# EAGLE design untitled (EAGLE 6.1)
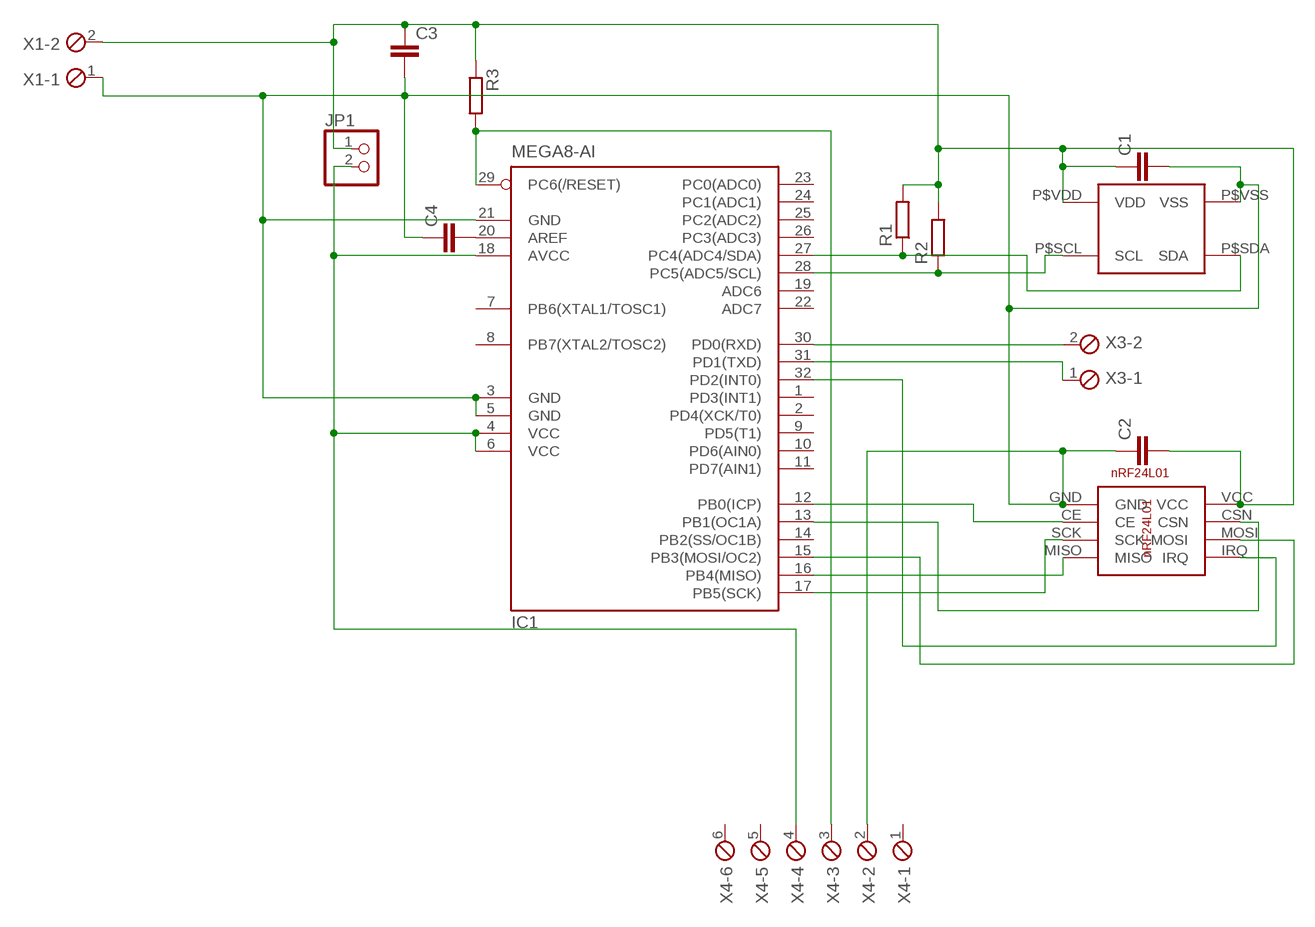
[diagram p0: schematic, sheet 1]

## Parts
C1  C-EUC1206  [C1206]
C2  C-EUC0805  [C0805]
C3  C-EU025-060X050  [C025-060X050]
C4  C-EUC0805K  [C0805K]
IC1  MEGA8-AI  [TQFP32-08]
JP1  PINHD-1X2  [1X02]
R1  R-EU_R0805  [R0805]
R2  R-EU_R0805  [R0805]
R3  R-EU_R0805  [R0805]
U$1  SHT21  [DFN6]
U$2  NRF24L01B  [B1]
X1  MPT2  [2POL254]
X3  MPT2  [2POL254]
X4  MPT6  [6POL254]

## Nets
N$1: IC1.32(PD2(INT0)) U$2.IRQ
N$2: IC1.15(PB3(MOSI/OC2)) U$2.MOSI
N$3: IC1.17(PB5(SCK)) U$2.SCK
N$4: IC1.16(PB4(MISO)) U$2.MISO
N$5: IC1.12(PB0(ICP)) U$2.CE
N$6: IC1.13(PB1(OC1A)) U$2.CSN
N$7: IC1.28(PC5(ADC5/SCL)) R2.1 U$1.P$SCL(SCL)
N$8: IC1.27(PC4(ADC4/SDA)) R1.1 U$1.P$SDA(SDA)
N$9: IC1.4(VCC) IC1.6(VCC) IC1.18(AVCC) JP1.2 X4.4
N$11: C4.2 IC1.20(AREF)
N$13: C1.2 C2.1 C3.2 C4.1 IC1.3(GND) IC1.5(GND) IC1.21(GND) U$1.P$VSS(VSS) U$2.GND X1.1 X4.2
N$14: C1.1 C2.2 C3.1 JP1.1 R1.2 R2.2 R3.1 U$1.P$VDD(VDD) U$2.VCC X1.2
N$17: IC1.29(PC6(/RESET)) R3.2 X4.3
N$21: IC1.30(PD0(RXD)) X3.2
N$22: IC1.31(PD1(TXD)) X3.1
Unconnected: IC1.1(PD3(INT1)) IC1.2(PD4(XCK/T0)) IC1.7(PB6(XTAL1/TOSC1)) IC1.8(PB7(XTAL2/TOSC2)) IC1.9(PD5(T1)) IC1.10(PD6(AIN0)) IC1.11(PD7(AIN1)) IC1.14(PB2(SS/OC1B)) IC1.19(ADC6) IC1.22(ADC7) IC1.23(PC0(ADC0)) IC1.24(PC1(ADC1)) IC1.25(PC2(ADC2)) IC1.26(PC3(ADC3)) X4.1 X4.5 X4.6

## Library data of the parts
C1 C2 C4 = resistor:C-EU: CAPACITOR, European symbol
C3 = rcl:C-EU: CAPACITOR, European symbol
IC1 = atmel:MEGA8: MICROCONTROLLER 8 Kbytes FLASH, 1 kbytes SRAM, 512 bytes EEPROM, USART, 6-channel 10 bit ADC, 2-channel 8 bit ADC Pin compatible with Atmega48, ATMega88, ATMega168 Source: avr.lbr; MPN: ATMEGA8-16AU; OC_FARNELL: 9171371; OC_NEWARK: 73M8863
JP1 = pinhead:PINHD-1X2: PIN HEADER
R1-R3 = resistor:R-EU_: RESISTOR, European symbol
U$1 = SHT21:SHT21
U$2 = nRF24L01:NRF24L01B
X1 X3 = con-phoenix-254:MPT2: PHOENIX CONNECTOR; OC_FARNELL: unknown; OC_NEWARK: unknown
X4 = con-phoenix-254:MPT6: PHOENIX CONNECTOR; OC_FARNELL: unknown; OC_NEWARK: unknown

## Board
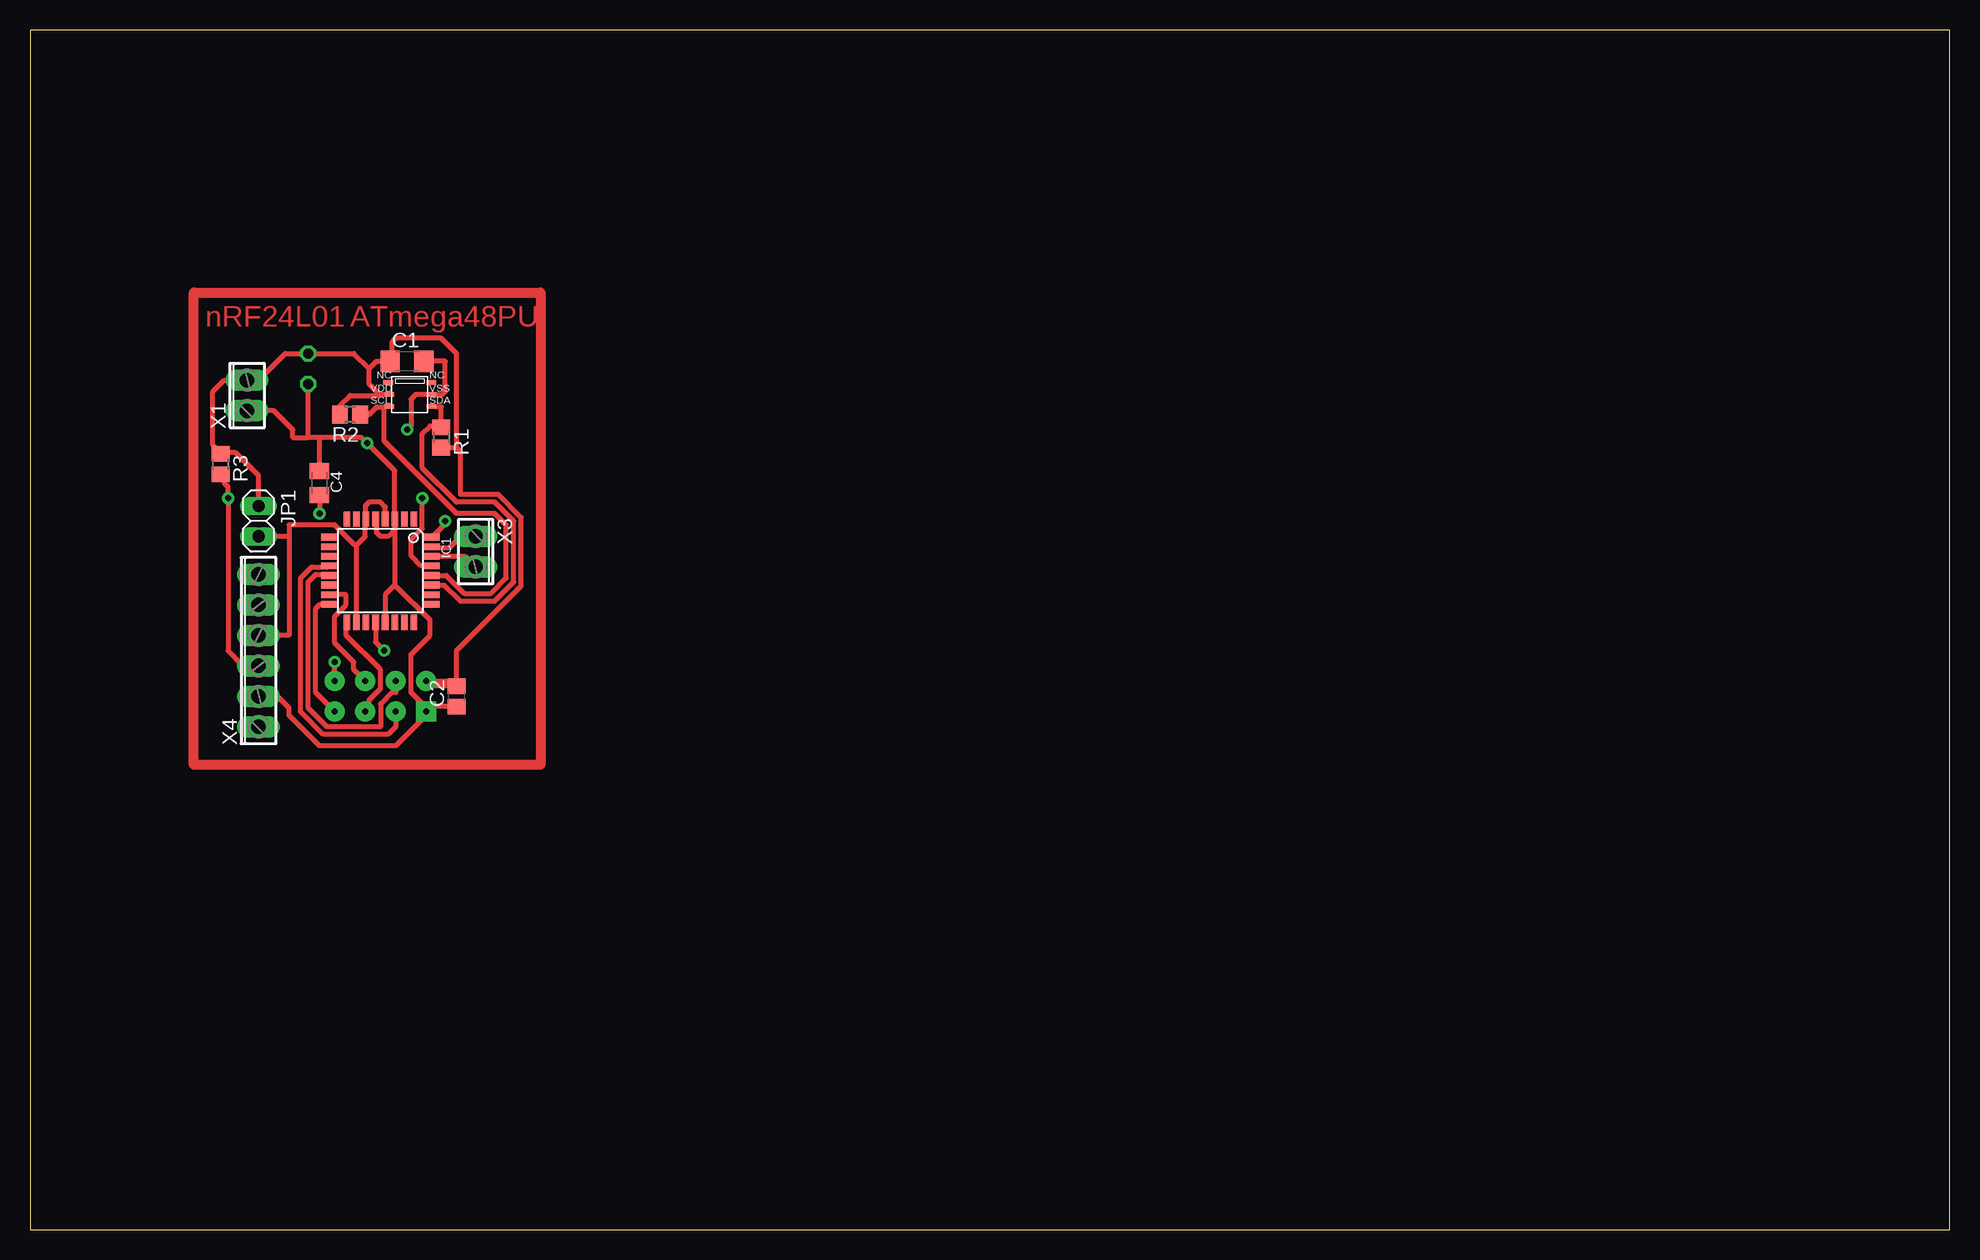
[diagram p1: board, top side]
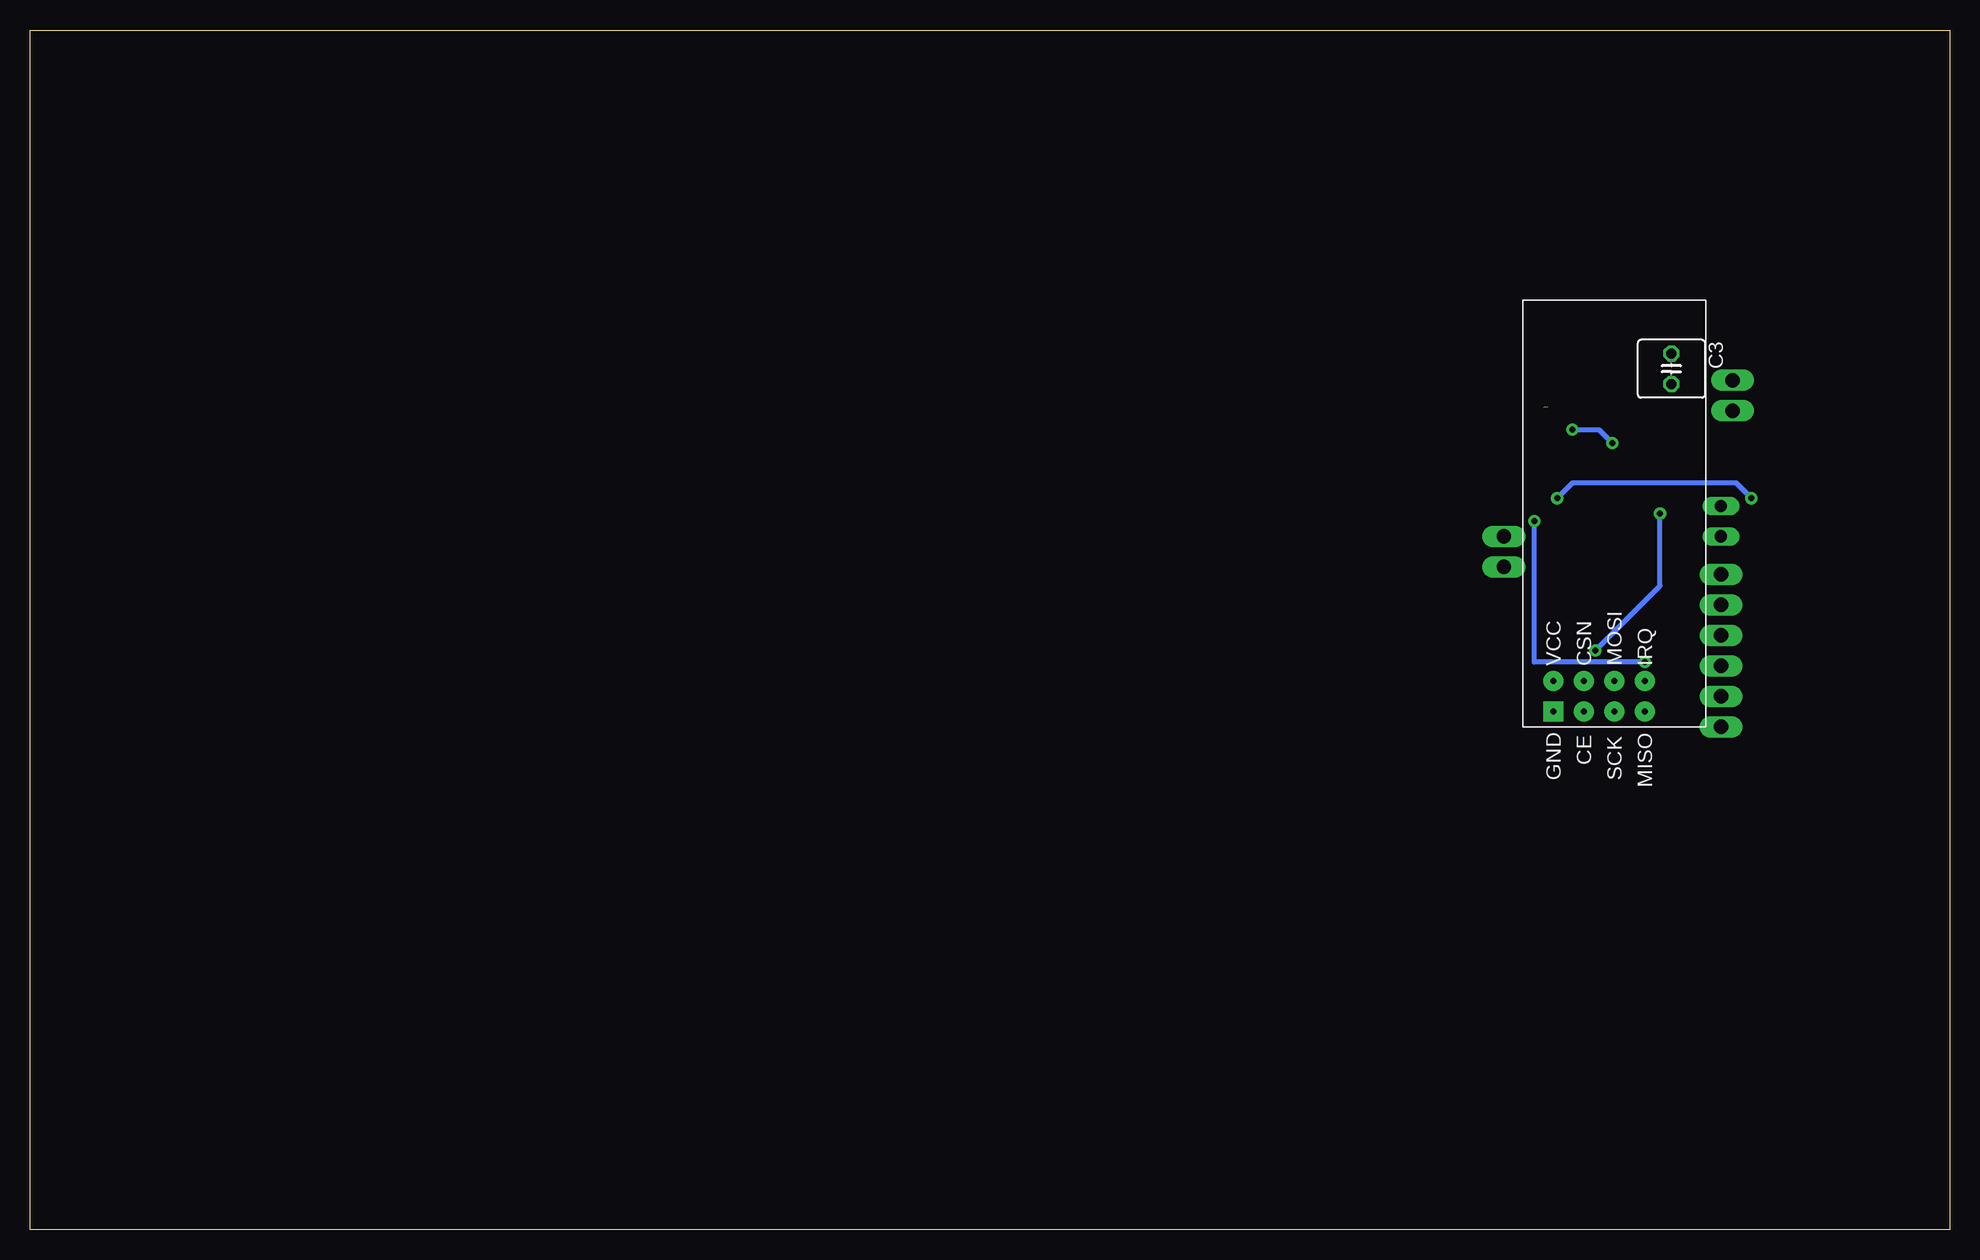
[diagram p2: board, bottom side, seen from below]

Size 160 x 100 mm. Coordinates in mm from the lower left corner, seen from the top.
Outline: 0,0 160,0 160,100 0,100 0,0
Copper layers (1*16): Top 0.035mm / dielectric 1.5mm / Bottom 0.035mm
Design rules: minimum track width 10mil, minimum drill 24mil, track to track 8mil, track to pad 8mil, pad to pad 8mil, via to via 8mil, smd to smd 8mil, copper to edge 40mil, drill to drill 8mil, minimum pad ring 10mil, minimum via ring 8mil, stop-mask expansion 4mil, vias tented up to drill 0mil, thermal gap 10mil

### Footprints (pad centres in the part's own frame; a part is rotated, then mirrored left to right if it is on the bottom)
C1206 = smd 1.6 x 1.8: 1 -1.4,0; 2 1.4,0
C0805 = smd 1.3 x 1.5: 1 -0.85,0; 2 0.85,0
C025-060X050 = drill 0.813 octagon: 1 -1.27,0; 2 1.27,0
C0805K = smd 1.3 x 1.6: 1 -1,0; 2 1,0
TQFP32-08 = smd 1.27 x 0.559: 1 -4.293,2.8; 2 -4.293,2; 3 -4.293,1.2; 4 -4.293,0.4; 5 -4.293,-0.4; 6 -4.293,-1.2; 7 -4.293,-2; 8 -4.293,-2.8; 17 4.293,-2.8; 18 4.293,-2; 19 4.293,-1.2; 20 4.293,-0.4; 21 4.293,0.4; 22 4.293,1.2; 23 4.293,2; 24 4.293,2.8 | smd 0.559 x 1.27: 9 -2.8,-4.293; 10 -2,-4.293; 11 -1.2,-4.293; 12 -0.4,-4.293; 13 0.4,-4.293; 14 1.2,-4.293; 15 2,-4.293; 16 2.8,-4.293; 25 2.8,4.293; 26 2,4.293; 27 1.2,4.293; 28 0.4,4.293; 29 -0.4,4.293; 30 -1.2,4.293; 31 -2,4.293; 32 -2.8,4.293
1X02 = drill 1.016 long: 1 -1.27,0; 2 1.27,0
R0805 = smd 1.3 x 1.5: 1 -0.85,0; 2 0.85,0
DFN6 = smd 0.813 x 0.406: P$NC1 -0.3,-0.5; P$NC2 3.3,-0.5; P$SCL -0.2,-2.5; P$SDA 3.3,-2.5; P$VDD -0.2,-1.5; P$VSS 3.3,-1.5
B1 = drill 0.5 pad 1.676: CE 1.27,-5.08; CSN 3.81,-5.08; IRQ 3.81,-10.16; MISO 1.27,-10.16; MOSI 3.81,-7.62; SCK 1.27,-7.62; VCC 3.81,-2.54 | drill 0.5 pad 1.676 square: GND 1.27,-2.54
2POL254 = drill 1.2 long: 1 -1.27,0; 2 1.27,0
6POL254 = drill 1.2 pad 1.778 long: 1 -6.35,0; 2 -3.81,0; 3 -1.27,0; 4 1.27,0; 5 3.81,0; 6 6.35,0

### Placement (x,y rotation side)
C1  31.43,72.39 0 top
C2  35.56,44.45 90 top
C3  23.18,71.75 270 bottom
C4  24.13,62.23 270 top
IC1  29.21,54.93 270 top
JP1  19.05,59.05 270 top
R1  34.29,66.04 270 top
R2  26.67,67.94 180 top
R3  15.88,63.82 270 top
U$1  30.16,71.12 0 top
U$2  35.56,41.91 90 bottom
X1  18.1,69.53 90 top
X3  37.15,56.52 270 top
X4  19.05,48.26 90 top

### Tracks (layer width: path | path; a pad name or v marks a point on that pad's centre or on a via)
N$1  (via drill 0.5 pad 1.02)
  Top 0.406: U$2.IRQ v25.4,47.31 | v34.61,59.05 34.61,58.83 IC1.32
  Bottom 0.406: v25.4,47.31 34.61,47.31 v34.61,59.05
N$2
  Top 0.406: U$2.MOSI 26.99,46.67 26.99,47.31 25.4,48.9 25.4,51.12 26.35,52.07 26.35,52.93 IC1.15
N$3
  Top 0.406: U$2.SCK 28.26,43.5 28.26,44.13 29.21,45.09 29.21,46.67 26.35,49.53 26.35,50.58 IC1.17
N$4
  Top 0.406: U$2.MISO 23.81,44.77 23.81,51.75 24.19,52.13 IC1.16
N$5
  Top 0.406: U$2.CE 30.48,41.91 29.84,41.27 24.45,41.27 22.54,43.18 22.54,54.29 23.5,55.24 24.84,55.24 IC1.12
N$6
  Top 0.406: U$2.CSN 30.48,44.77 30.16,44.77 29.21,43.81 29.21,41.91 24.77,41.91 23.18,43.5 23.18,53.98 23.81,54.61 24.84,54.61 IC1.13
N$7
  Top 0.406: IC1.28 34.69,54.53 36.2,53.02 38.42,53.02 39.69,54.29 39.69,58.74 38.73,59.69 35.56,59.69 29.53,65.72 29.53,68.54 | 29.53,68.54 29.61,68.62 U$1.P$SCL | R2.1 28.26,67.94 28.89,68.58 29.53,68.58 29.53,68.54
N$8  (1 unrouted)
  Top 0.406: 33.82,68.58 34.29,68.58 R1.1 34.19,66.99 33.34,66.99 32.7,66.36 32.7,63.5 35.56,60.64 38.73,60.64 40.32,59.05 40.32,53.98 38.73,52.39 35.88,52.39 34.54,53.73 IC1.27
N$9
  Top 0.406: IC1.4 29.61,60.24 29.21,60.64 28.26,60.64 27.94,60.33 27.94,59.15 | IC1.18 27.21,57.05 | 27.21,57.05 27.94,57.78 27.94,59.15 | 27.94,59.15 IC1.6 | 27.21,57.05 27.08,57.05 25.4,58.74 21.59,58.74 21.59,57.78 | 21.59,57.78 JP1.2 | 21.59,57.78 21.59,49.53 X4.4
N$10
  Top 0.813: 13.65,78.11 42.55,78.11 42.55,38.73 13.65,38.73 13.65,78.11
N$11  (via drill 0.5 pad 1.02)
  Top 0.406: IC1.20 28.81,48.98 v29.53,48.26 | C4.2 v24.13,59.69
  Bottom 0.406: v29.53,48.26 24.13,53.66 v24.13,59.69
N$13  (via drill 0.5 pad 1.02)
  Top 0.406: C2.1 33.02,43.6 | 33.02,43.6 U$2.GND 33.02,42.86 30.48,40.32 24.13,40.32 21.59,42.86 21.59,43.5 20.64,44.45 X4.2 | 33.02,43.6 32.92,43.6 31.75,44.77 31.75,47.94 33.34,49.53 33.34,50.8 30.41,53.73 | IC1.3 30.41,58.35 29.84,57.78 29.21,57.78 28.89,58.1 28.89,59.14 IC1.5 | IC1.3 30.41,53.73 | IC1.3 30.41,63.25 v28.1,65.56 27.62,66.04 24.13,66.04 | 30.41,53.73 29.61,52.93 IC1.21 | C1.2 34.61,72.39 34.61,69.85 34.38,69.62 U$1.P$VSS 32.16,69.62 31.75,69.22 31.75,66.99 v31.43,66.67 | X1.1 20.32,68.26 21.91,66.67 21.91,66.04 23.18,66.04 | C4.1 24.13,66.04 | 24.13,66.04 23.18,66.04 | 23.18,66.04 C3.2
  Bottom 0.406: v31.43,66.67 29.21,66.67 v28.1,65.56
N$14
  Top 0.406: R1.2 35.56,65.19 | 35.56,65.19 35.56,73.03 34.29,74.3 30.48,74.3 30.16,73.98 30.16,72.52 C1.1 28.89,72.39 28.26,71.75 | C2.2 33.02,45.3 U$2.VCC 35.24,45.72 35.56,45.4 35.56,48.26 40.96,53.66 40.96,59.37 39.05,61.28 35.88,61.28 35.88,64.87 35.56,65.19 | U$1.P$VDD 29.12,69.62 29.05,69.69 | 29.05,69.69 28.26,70.48 28.26,71.75 | JP1.1 19.05,62.87 17.14,64.77 15.98,64.77 R3.1 15.88,64.77 15.24,65.41 15.24,69.85 16.19,70.8 X1.2 19.05,70.8 21.27,73.03 C3.1 26.99,73.03 28.26,71.75 | R2.2 25.82,68.68 26.67,69.53 28.89,69.53 29.05,69.69
N$17  (via drill 0.5 pad 1.02)
  Top 0.406: IC1.29 32.62,55.33 31.75,56.2 31.75,57.47 32.7,58.42 v32.7,60.96 | R3.2 16.19,62.65 16.19,62.23 16.51,61.91 v16.51,60.96 16.51,48.26 17.78,46.99 X4.3
  Bottom 0.406: v16.51,60.96 17.78,62.23 31.43,62.23 v32.7,60.96
N$21
  Top 0.406: IC1.30 36.27,56.13 X3.2
N$22
  Top 0.406: X3.1 35.88,57.78 34.92,56.83 33.6,56.83 IC1.31

### Text on the board
Top: nRF24L01 | ATmega48PU